# EAGLE design shield_SFM10R1 (EAGLE 7.5.0)
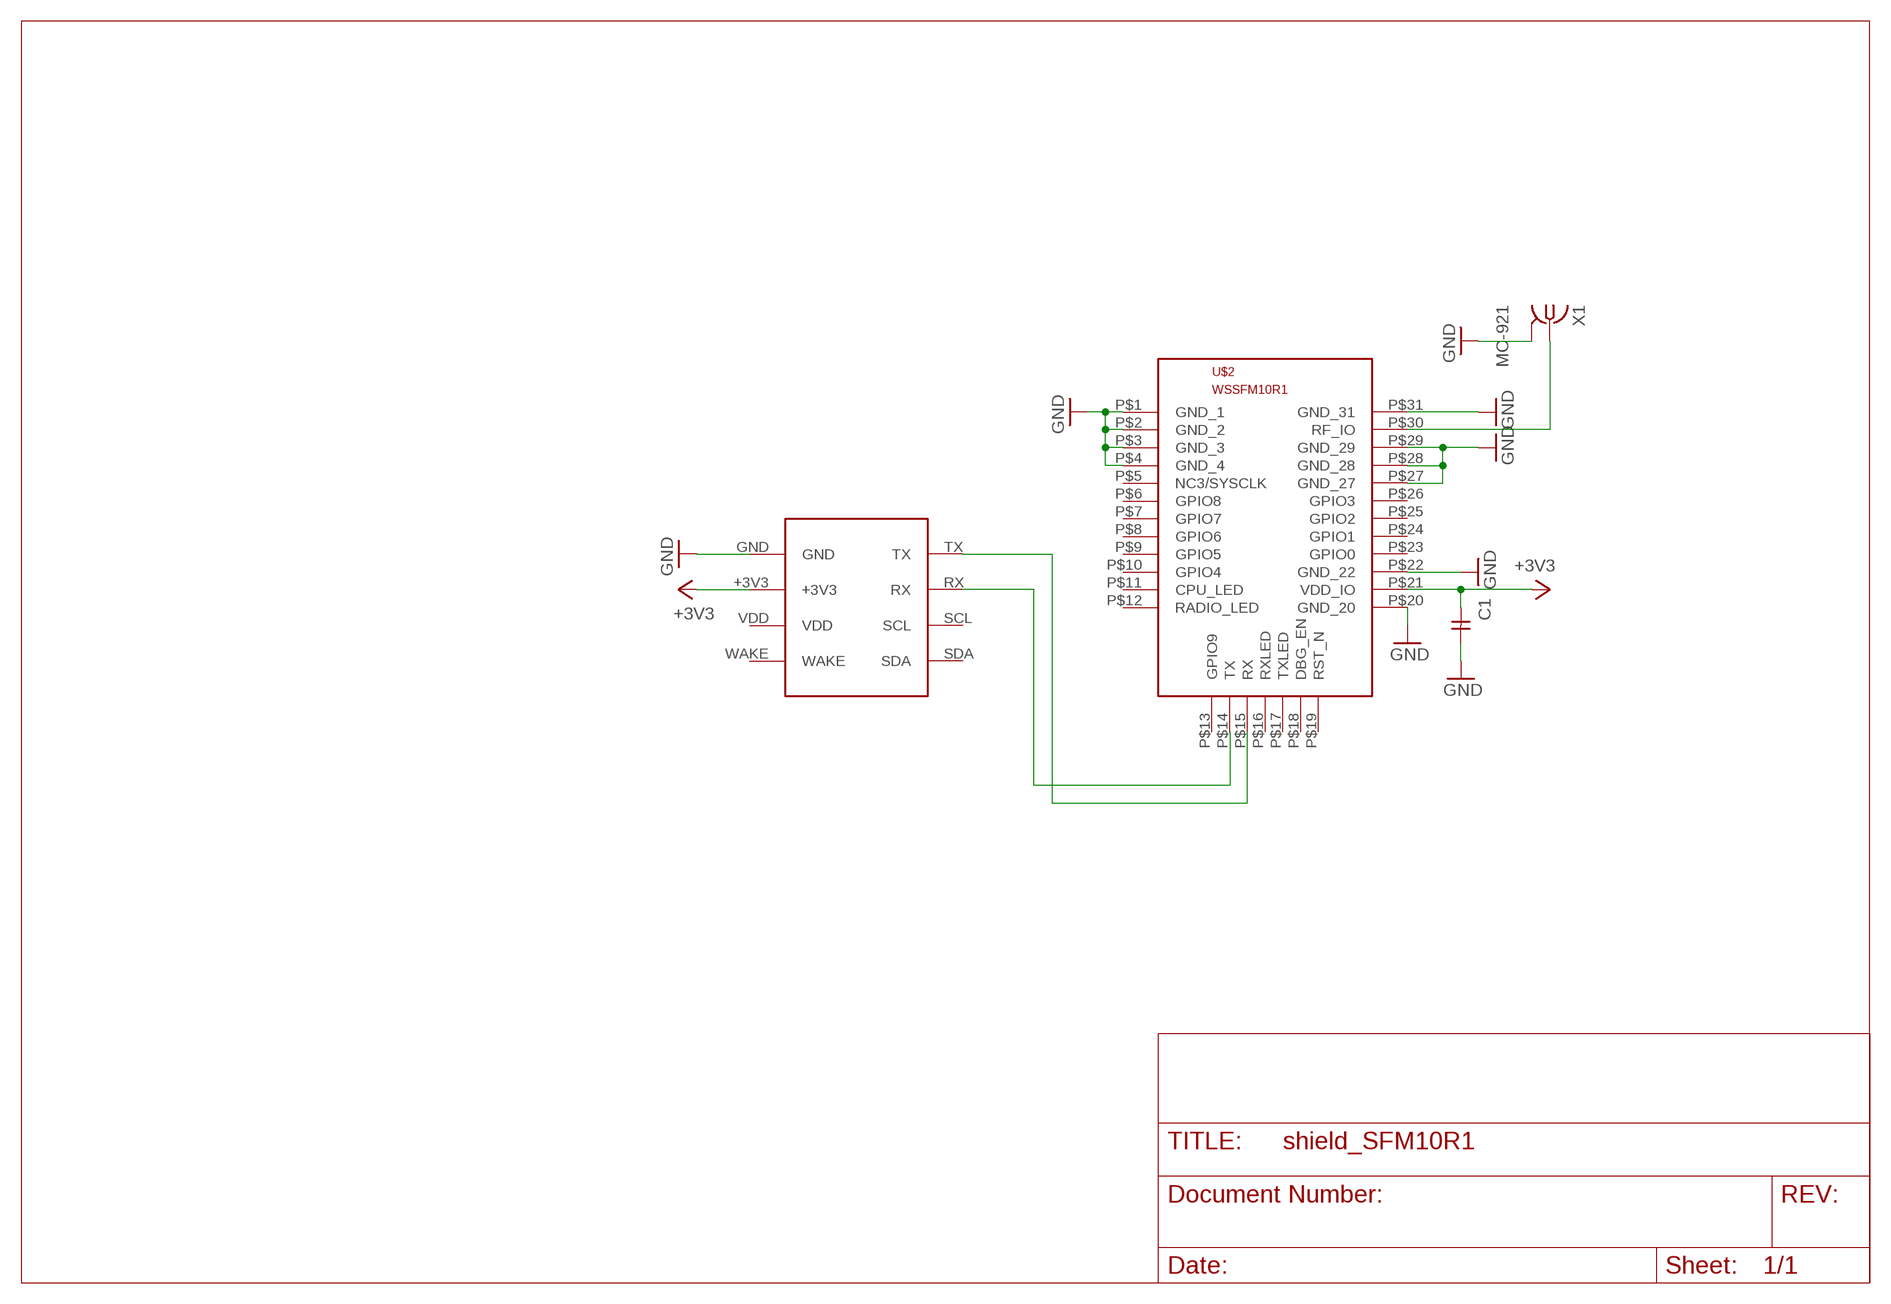
[diagram p0: schematic, sheet 1]

## Parts
C1  CSMD_1206  [SMD_RC_1206]
U$1  SHIELD  [SHIELD]
U$2  SFM10R1  [SFM10R1]
X1  MC-921  [MC-921]

## Nets
+3V3: C1.P$1 U$1.+3V3 U$2.P$21(VDD_IO)
GND: C1.P$2 U$1.GND U$2.P$1(GND_1) U$2.P$2(GND_2) U$2.P$3(GND_3) U$2.P$4(GND_4) U$2.P$20(GND_20) U$2.P$22(GND_22) U$2.P$27(GND_27) U$2.P$28(GND_28) U$2.P$29(GND_29) U$2.P$31(GND_31) X1.2@1(GND) X1.2@2(GND)
N$1: U$1.TX U$2.P$15(RX)
N$2: U$1.RX U$2.P$14(TX)
N$4: U$2.P$30(RF_IO) X1.1
Unconnected: U$1.SCL U$1.SDA U$1.WAKE U$2.P$5(NC3/SYSCLK) U$2.P$6(GPIO8) U$2.P$7(GPIO7) U$2.P$8(GPIO6) U$2.P$9(GPIO5) U$2.P$10(GPIO4) U$2.P$11(CPU_LED) U$2.P$12(RADIO_LED) U$2.P$13(GPIO9) U$2.P$16(RXLED) U$2.P$17(TXLED) U$2.P$18(DBG_EN) U$2.P$19(RST_N) U$2.P$23(GPIO0) U$2.P$24(GPIO1) U$2.P$25(GPIO2) U$2.P$26(GPIO3)

## Power pins joined to a net without a drawn wire
VDD: U$1.VDD

## Library data of the parts
C1 = balance:C
U$1 = balance:SHIELD
U$2 = balance:SFM10R1
X1 = con-coax:MC-921: COAX. MICROWAVE CONNECTOR O/D diam 2.1 Source: www.tycoelectronics.com .. Electronics .. ENG_CD_1775146_A2.pdf; OC_FARNELL: unknown; OC_NEWARK: unknown

## Net classes
0 default: clearance 0.205 mm

## Board
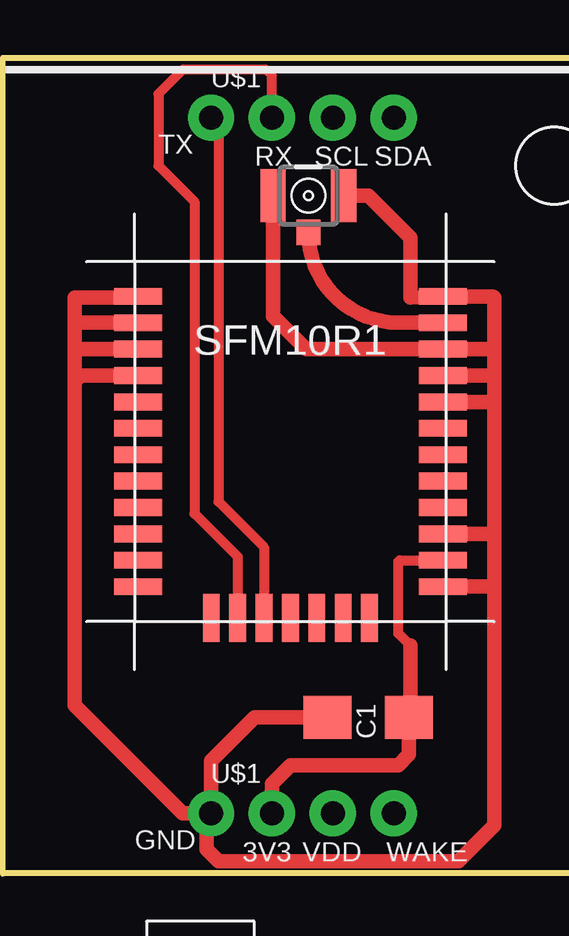
[diagram p1: board, top side]

No outline drawn. Coordinates in mm, seen from the top.
Copper layers (1*16): Top 0.035mm / dielectric 1.5mm / Bottom 0.035mm
Design rules "SeeedStudio_2layer_DRU_no_angle_20140221": minimum track width 6mil, minimum drill 12mil, track to track 6mil, track to pad 6mil, pad to pad 6mil, via to via 6mil, smd to smd 0mil, copper to edge 10mil, drill to drill 10mil, minimum pad ring 10mil, minimum via ring 6mil, stop-mask expansion 2mil, vias tented up to drill 100mil, thermal gap 10mil
Milling: 4 lines

### Footprints (pad centres in the part's own frame; a part is rotated, then mirrored left to right if it is on the bottom)
SMD_RC_1206 = smd 2 x 1.8: P$1 -1.7,0; P$2 1.7,0
SHIELD = drill 1 pad 1.93: +3V3 36.73,23; GND 34.19,23; RX 36.73,52; SCL 39.27,52; SDA 41.81,52; TX 34.19,52; VDD 39.27,23; WAKE 41.81,23
SFM10R1 = smd 2 x 0.7: P$1 -6.35,6.05; P$2 -6.35,4.95; P$3 -6.35,3.85; P$4 -6.35,2.75; P$5 -6.35,1.65; P$6 -6.35,0.55; P$7 -6.35,-0.55; P$8 -6.35,-1.65; P$9 -6.35,-2.75; P$10 -6.35,-3.85; P$11 -6.35,-4.95; P$12 -6.35,-6.05; P$20 6.35,-6.05; P$21 6.35,-4.95; P$22 6.35,-3.85; P$23 6.35,-2.75; P$24 6.35,-1.65; P$25 6.35,-0.55; P$26 6.35,0.55; P$27 6.35,1.65; P$28 6.35,2.75; P$29 6.35,3.85; P$30 6.35,4.95; P$31 6.35,6.05 | smd 0.7 x 2: P$13 -3.3,-7.35; P$14 -2.2,-7.35; P$15 -1.1,-7.35; P$16 0,-7.35; P$17 1.1,-7.35; P$18 2.2,-7.35; P$19 3.3,-7.35
MC-921 = smd 1 x 1.05: 1 0,1.528 | smd 1.05 x 2.2: 2@1 -1.475,0; 2@2 1.475,0

### Placement (x,y rotation side)
C1  15.25,6.5 180 top
U$1  -25.5,-20.5 0 top
U$2  12,18 0 top
X1  12.75,28.25 180 top

### Tracks (layer width: path | path; a pad name or v marks a point on that pad's centre or on a via)
+3V3
  Top 0.406: 17,9.5 16.5,10 16.5,13 16.55,13.05 U$2.P$21
  Top 0.61: U$1.+3V3 11.23,3.73 12,4.5 16.5,4.5 16.95,4.95 C1.P$1 17,6.55 17,9.5
GND
  Top 0.61: C1.P$2 10.5,6.5 8.69,4.69 U$1.GND | U$1.GND 7.5,2.5 3,7 3,20.5 | 3,20.5 3,22 | 3,22 3,23 | 3,23 3,24 5.6,24 U$2.P$1 | U$2.P$2 3.05,22.95 3,23 | U$2.P$3 3.15,21.85 3,22 | U$2.P$4 3.25,20.75 3,20.5 | 20.5,22 20.5,24 20.45,24.05 U$2.P$31 17,24 17,26.5 15.25,28.25 X1.2@1 | 20.5,22 20.5,20.75 | 20.5,20.75 20.5,19.65 | 20.5,19.65 20.5,14.15 | 20.5,14.15 20.5,11.95 | 20.5,11.95 20.5,2 19,0.5 9,0.5 8.5,1 8.5,2.31 U$1.GND | 20.5,22 20.35,21.85 U$2.P$29 12.65,21.85 11.28,23.23 X1.2@2 | U$2.P$28 20.5,20.75 | U$2.P$27 20.5,19.65 | U$2.P$22 20.5,14.15 | U$2.P$20 20.5,11.95
N$1
  Top 0.406: U$1.TX 9,31.19 9,15.5 10.9,13.6 U$2.P$15
N$2
  Top 0.406: U$1.RX 11.23,33.27 11,33.5 7.5,33.5 6.5,32.5 6.5,29.5 8,28 8,15 9.8,13.2 U$2.P$14
N$4
  Top 0.61: U$2.P$30 16.52,22.95 arc-90 X1.1